# EAGLE schematic BM019_Eagle_Copy (EAGLE 7.7.0)
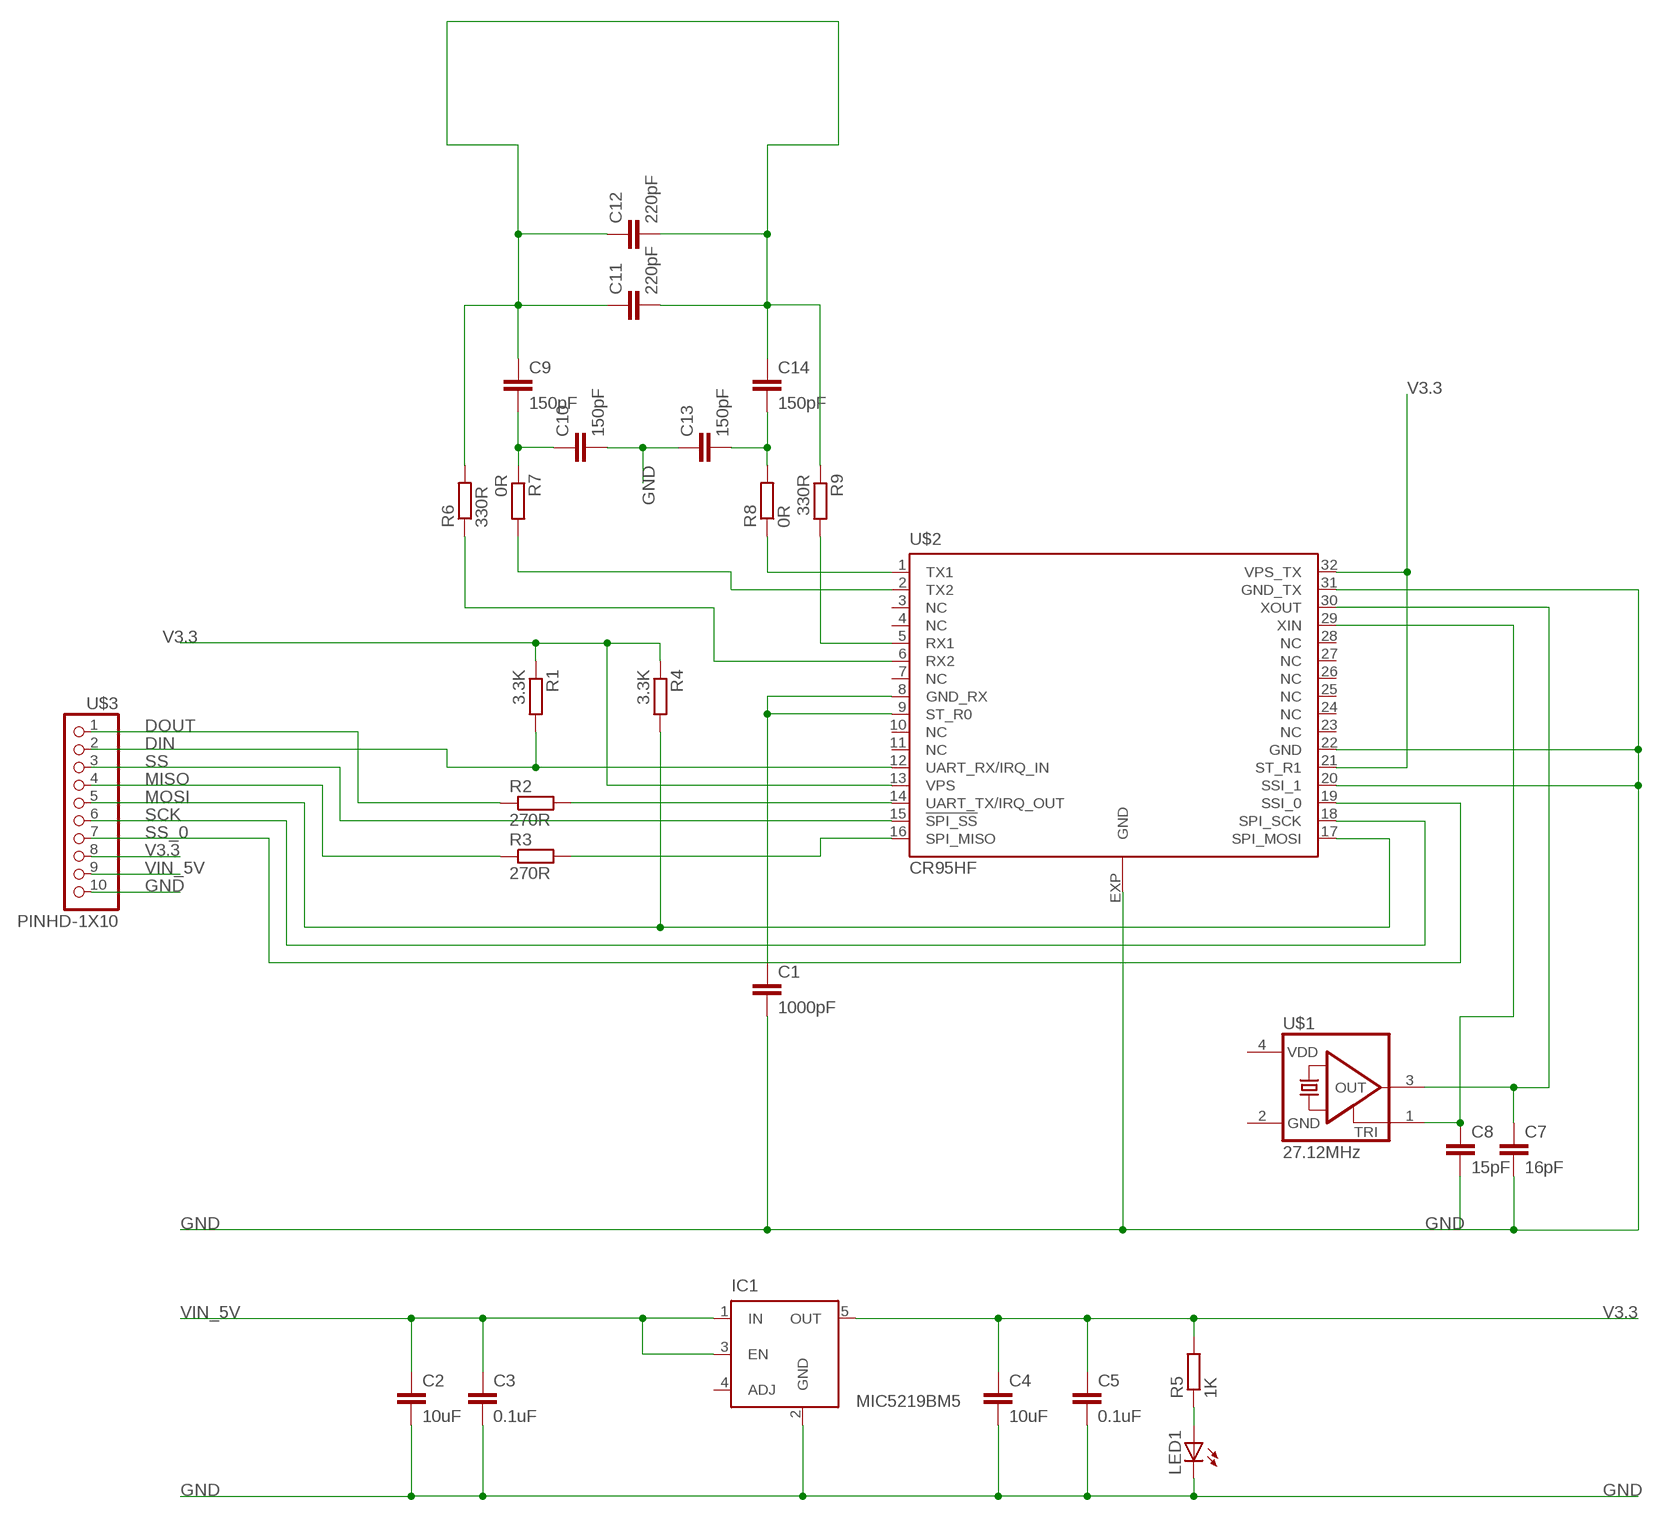
[diagram p0: schematic, sheet 1]

## Parts
C1  1000pF  C-EUC0603  [C0603]
C2  10uF  C-EUC0603  [C0603]
C3  0.1uF  C-EUC0603  [C0603]
C4  10uF  C-EUC0603  [C0603]
C5  0.1uF  C-EUC0603  [C0603]
C7  16pF  C-EUC0603  [C0603]
C8  15pF  C-EUC0603  [C0603]
C9  150pF  C-EUC0603  [C0603]
C10  150pF  C-EUC0603  [C0603]
C11  220pF  C-EUC0603  [C0603]
C12  220pF  C-EUC0603  [C0603]
C13  150pF  C-EUC0603  [C0603]
C14  150pF  C-EUC0603  [C0603]
IC1  MIC5219BM5  [SOT23-5]
LED1  LEDCHIPLED_0603  [CHIPLED_0603]
R1  3.3K  R-EU_R0603  [R0603]
R2  270R  R-EU_R0603  [R0603]
R3  270R  R-EU_R0603  [R0603]
R4  3.3K  R-EU_R0603  [R0603]
R5  1K  R-EU_R0603  [R0603]
R6  330R  R-EU_R0603  [R0603]
R7  0R  R-EU_R0603  [R0603]
R8  0R  R-EU_R0603  [R0603]
R9  330R  R-EU_R0603  [R0603]
U$1  27.12MHz  ASE  [ASE]
U$2  CR95HF  [VFQFPN32]
U$3  PINHD-1X10  [1X10-BIG]

## Nets
DIN: R1.2 U$2.12(UART_RX/IRQ_IN) U$3.2
DOUT: R2.1 U$3.1
GND: C1.2 C2.2 C3.2 C4.2 C5.2 C7.2 C8.2 C10.2 C13.1 IC1.2(GND) LED1.C U$2.20(SSI_1) U$2.22(GND) U$2.31(GND_TX) U$2.EXP(GND) U$3.10
MISO: R3.1 U$3.4
MOSI: R4.2 U$2.17(SPI_MOSI) U$3.5
N$1: R7.2 U$2.2(TX2)
N$2: R3.2 U$2.16(SPI_MISO)
N$3: R8.1 U$2.1(TX1)
N$4: R9.2 U$2.5(RX1)
N$6: R2.2 U$2.14(UART_TX/IRQ_OUT)
N$8: LED1.A R5.1
N$14: C1.1 U$2.8(GND_RX) U$2.9(ST_R0)
N$19: C9.2 C10.1 R7.1
N$20: C13.2 C14.2 R8.2
N$23: C9.1 C11.1 C11.2 C12.1 C12.2 C14.1 R6.2 R9.1
N$24: C8.1 U$1.1(TRI) U$2.29(XIN)
N$25: C7.1 U$1.3(OUT) U$2.30(XOUT)
N$26: R6.1 U$2.6(RX2)
SCK: U$2.18(SPI_SCK) U$3.6
SS: U$2.15(!SPI_SS) U$3.3
SS_0: U$2.19(SSI_0) U$3.7
V3.3: C4.1 C5.1 IC1.5(OUT) R1.1 R4.1 R5.2 U$2.13(VPS) U$2.21(ST_R1) U$2.32(VPS_TX) U$3.8
VIN_5V: C2.1 C3.1 IC1.1(IN) IC1.3(EN) U$3.9
Unconnected: IC1.4(ADJ) U$2.3(NC) U$2.11(NC) U$2.23(NC) U$2.24(NC) U$2.25(NC) U$2.26(NC) U$2.27(NC) U$2.28(NC)

## Power pins joined to a net without a drawn wire
GND: U$1.2(GND)
NC: U$2.4(NC) U$2.7(NC) U$2.10(NC)
VDD: U$1.4(VDD)

## Library data of the parts
C1-C5 C7-C14 = rcl:C-EU: CAPACITOR, European symbol
IC1 = v-reg-micrel:MIC5219BM5: VOLTAGE REGULATOR; MF: ALTERA CORPORATION; MPN: MIC5219BM5 TR; OC_FARNELL: 1100656; OC_NEWARK: 09J8939
LED1 = led:LED: LED OSRAM: - CHIPLED LG R971, LG N971, LY N971, LG Q971, LY Q971, LO R971, LY R971 LH N974, LH R974 LS Q976, LO Q976, LY Q976 LO Q996 - Hyper CHIPLED LW Q18S LB Q993, LB Q99A, LB R99A - SideLED LS A670, LO A670, LY A670, LG A670, LP A670 LB A673, LV A673, LT A673, LW A673 LH A674 LY A675 LS A676, LA A676, LO A676, LY A676, LW A676 LS A679, LY A679, LG A679 - Hyper Micro SIDELED® LS Y876, LA Y876, LO Y876, LY Y876 LT Y87S - SmartLED LW L88C, LW L88S LB L89C, LB L89S, LG L890 LS L89K, LO L89K, LY L89K LS L896, LA L896, LO L896, LY L896 - TOPLED LS T670, LO T670, LY T670, LG T670, LP T670 LSG T670, LSP T670, LSY T670, LOP T670, LYG T670 LG T671, LOG T671, LSG T671 LB T673, LV T673, LT T673, LW T673 LH T674 LS T676, LA T676, LO T676, LY T676, LB T676, LH T676, LSB T676, LW T676 LB T67C, LV T67C, LT T67C, LS T67K, LO T67K, LY T67K, LW E67C LS E67B, LA E67B, LO E67B, LY E67B, LB E67C, LV E67C, LT E67C LW T67C LS T679, LY T679, LG T679 LS T770, LO T770, LY T770, LG T770, LP T770 LB T773, LV T773, LT T773, LW T773 LH T774 LS E675, LA E675, LY E675, LS T675 LS T776, LA T776, LO T776, LY T776, LB T776 LHGB T686 LT T68C, LB T68C - Hyper Mini TOPLED® LB M676 - Mini TOPLED Santana® LG M470 LS M47K, LO M47K, LY M47K Source: http://www.osram.convergy.de LUXEON: - LUMILED® LXK2-PW12-R00, LXK2-PW12-S00, LXK2-PW14-U00, LXK2-PW14-V00 LXK2-PM12-R00, LXK2-PM12-S00, LXK2-PM14-U00 LXK2-PE12-Q00, LXK2-PE12-R00, LXK2-PE12-S00, LXK2-PE14-T00, LXK2-PE14-U00 LXK2-PB12-K00, LXK2-PB12-L00, LXK2-PB12-M00, LXK2-PB14-N00, LXK2-PB14-P00, LXK2-PB14-Q00 LXK2-PR12-L00, LXK2-PR12-M00, LXK2-PR14-Q00, LXK2-PR14-R00 LXK2-PD12-Q00, LXK2-PD12-R00, LXK2-PD12-S00 LXK2-PH12-R00, LXK2-PH12-S00 LXK2-PL12-P00, LXK2-PL12-Q00, LXK2-PL12-R00 Source: www.luxeon.com KINGBRIGHT: KA-3528ASYC Source: www.kingbright.com
R1-R9 = rcl:R-EU_: RESISTOR, European symbol
U$1 = crystal:ASE: 3.3Vdc CMOS SMD CRYSTAL CLOCK OSCILLATOR SOurce: www.abracon.com; OC_FARNELL: unknown; OC_NEWARK: unknown
U$2 = CR95HF:CR95HF
U$3 = adafruit:PINHD-1X10: Pin header 1x10 0.1" spacing With round pins